# Altium schematic sheet child3.SchDoc
size A3
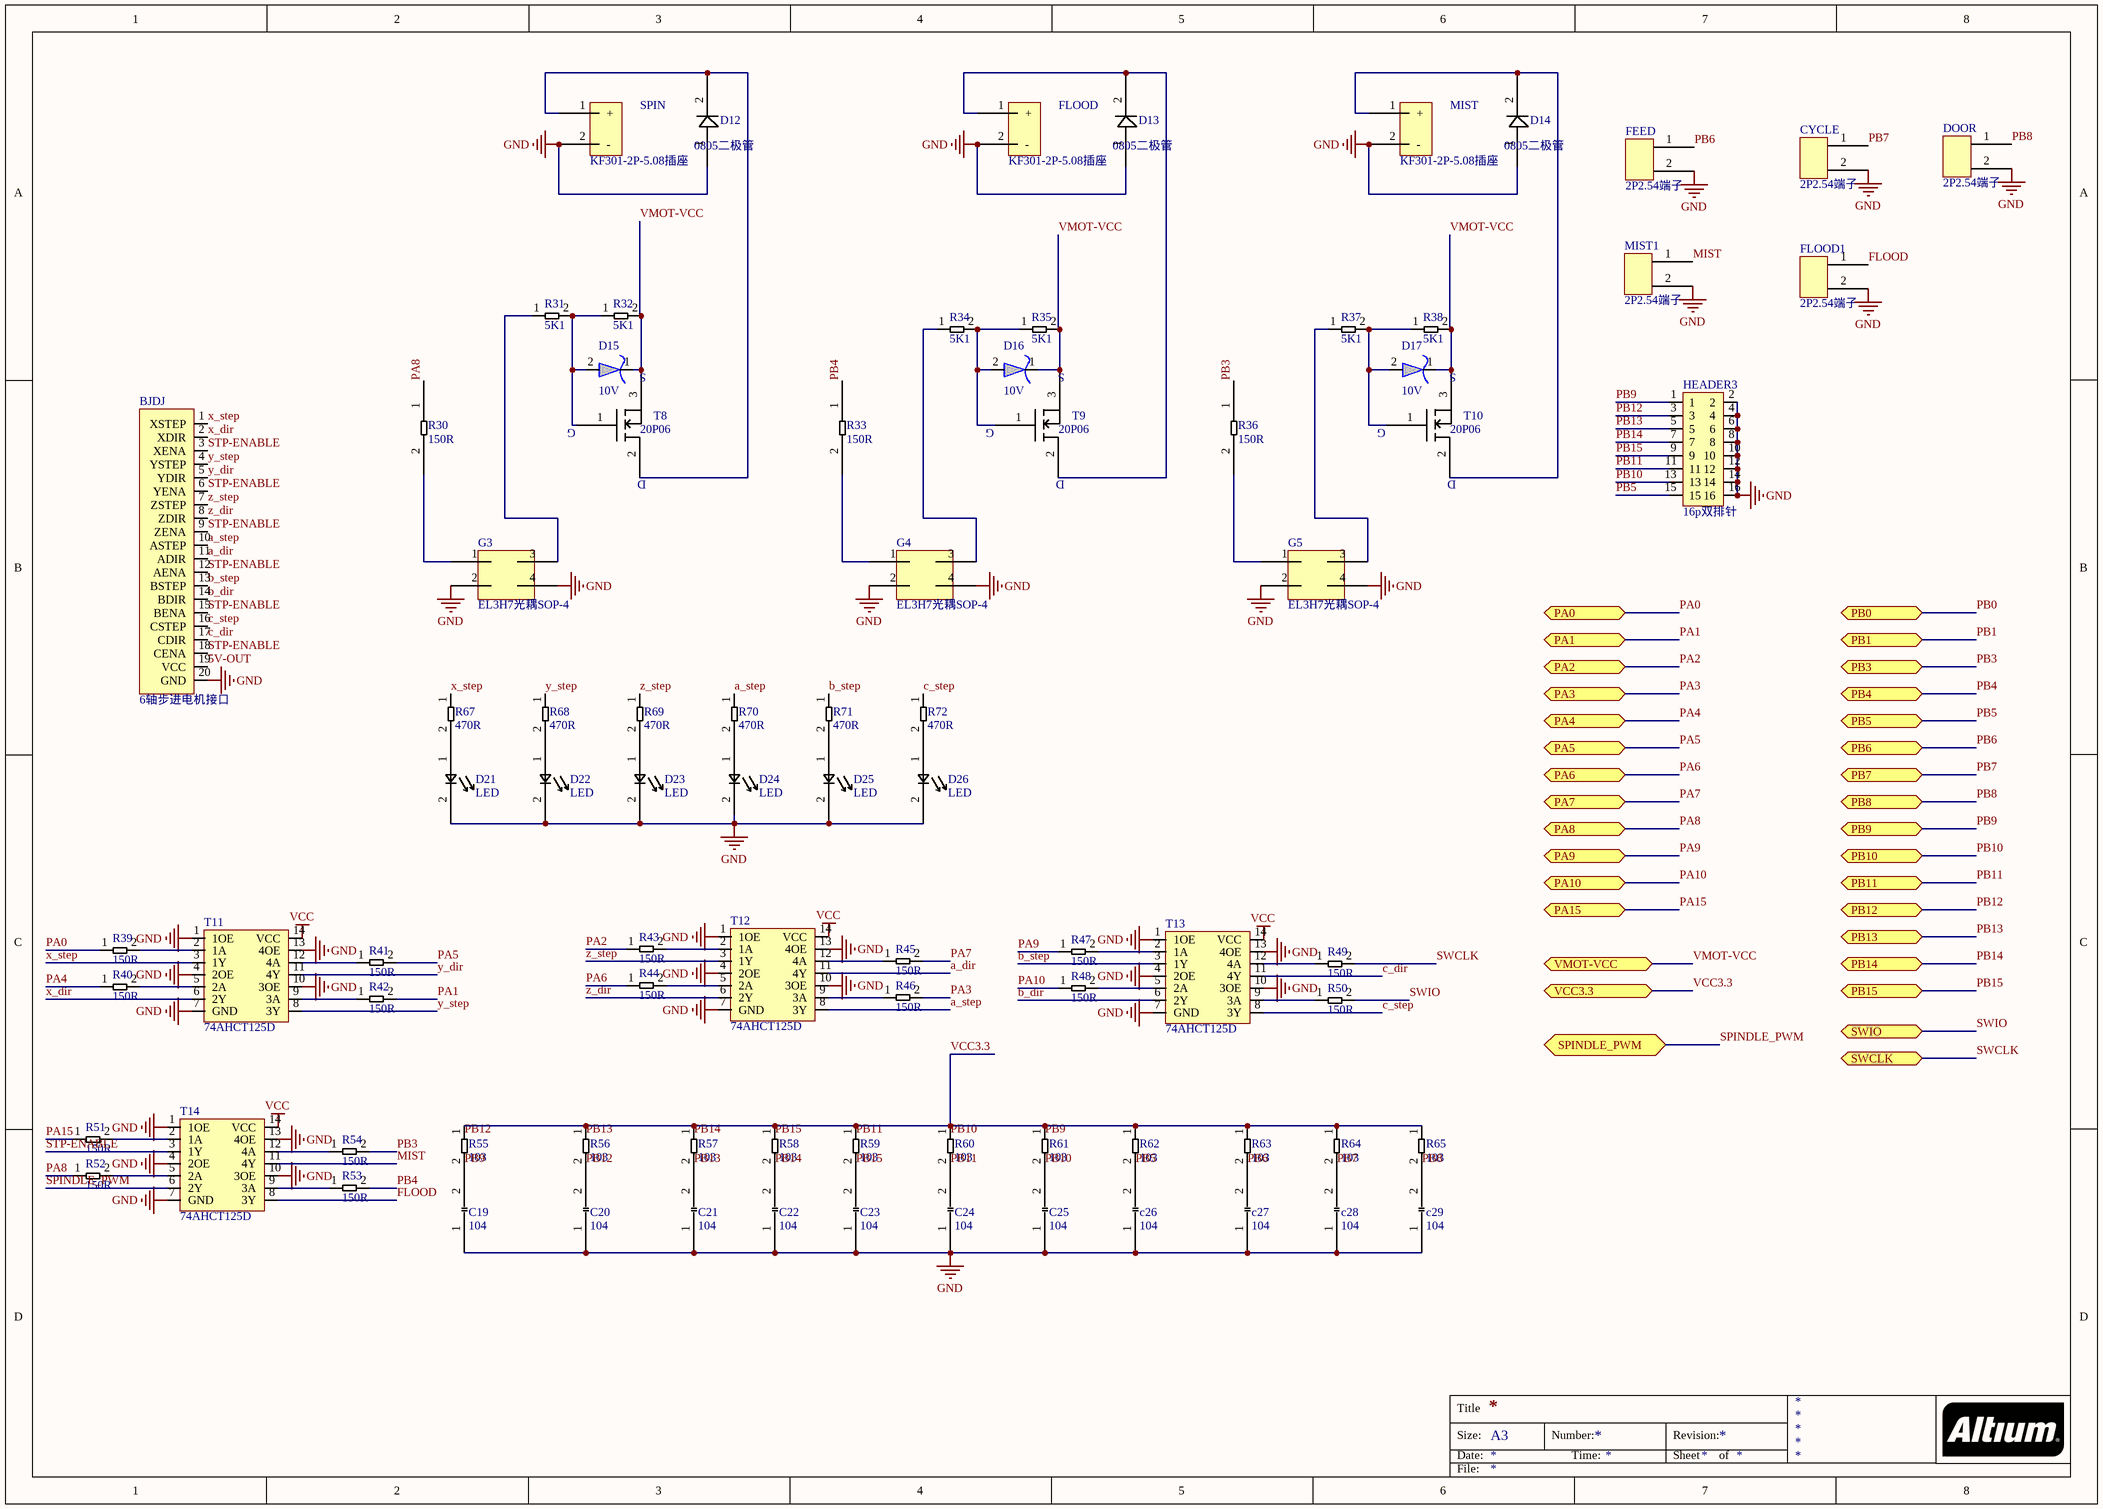
[diagram p0: child3.SchDoc]

## Parts
BJDJ  6轴步进电机接口  [KF301-20P]
C19  104  [0805电容]
C20  104  [0805电容]
C21  104  [0805电容]
C22  104  [0805电容]
C23  104  [0805电容]
C24  104  [0805电容]
C25  104  [0805电容]
c26  104  [0805电容]
c27  104  [0805电容]
c28  104  [0805电容]
c29  104  [0805电容]
CYCLE  2P2.54端子  [2p2.54端子]
D12  0805二极管  [0805-二极管]
D13  0805二极管  [0805-二极管]
D14  0805二极管  [0805-二极管]
D15  10V  [1/2w贴片稳压二极管]
D16  10V  [1/2w贴片稳压二极管]
D17  10V  [1/2w贴片稳压二极管]
D21  LED  [0805二极管]
D22  LED  [0805二极管]
D23  LED  [0805二极管]
D24  LED  [0805二极管]
D25  LED  [0805二极管]
D26  LED  [0805二极管]
DOOR  2P2.54端子  [2p2.54端子]
FEED  2P2.54端子  [2p2.54端子]
FLOOD  KF301-2P-5.08插座  [KF301-2P-5.08插座]
FLOOD1  2P2.54端子  [2p2.54端子]
G3  EL3H7光耦SOP-4  [EL3H7SOP-4]
G4  EL3H7光耦SOP-4  [EL3H7SOP-4]
G5  EL3H7光耦SOP-4  [EL3H7SOP-4]
HEADER3  16p双排针  [16p双排针]
MIST  KF301-2P-5.08插座  [KF301-2P-5.08插座]
MIST1  2P2.54端子  [2p2.54端子]
R30  150R  [0805电阻]
R31  5K1  [0805电阻]
R32  5K1  [0805电阻]
R33  150R  [0805电阻]
R34  5K1  [0805电阻]
R35  5K1  [0805电阻]
R36  150R  [0805电阻]
R37  5K1  [0805电阻]
R38  5K1  [0805电阻]
R39  150R  [0805电阻]
R40  150R  [0805电阻]
R41  150R  [0805电阻]
R42  150R  [0805电阻]
R43  150R  [0805电阻]
R44  150R  [0805电阻]
R45  150R  [0805电阻]
R46  150R  [0805电阻]
R47  150R  [0805电阻]
R48  150R  [0805电阻]
R49  150R  [0805电阻]
R50  150R  [0805电阻]
R51  150R  [0805电阻]
R52  150R  [0805电阻]
R53  150R  [0805电阻]
R54  150R  [0805电阻]
R55  103  [0805电阻]
R56  103  [0805电阻]
R57  103  [0805电阻]
R58  103  [0805电阻]
R59  103  [0805电阻]
R60  103  [0805电阻]
R61  103  [0805电阻]
R62  103  [0805电阻]
R63  103  [0805电阻]
R64  103  [0805电阻]
R65  103  [0805电阻]
R67  470R  [0805电阻]
R68  470R  [0805电阻]
R69  470R  [0805电阻]
R70  470R  [0805电阻]
R71  470R  [0805电阻]
R72  470R  [0805电阻]
SPIN  KF301-2P-5.08插座  [KF301-2P-5.08插座]
T8  20P06  [to-252]
T9  20P06  [to-252]
T10  20P06  [to-252]
T11  74AHCT125D  [SOIC14]
T12  74AHCT125D  [SOIC14]
T13  74AHCT125D  [SOIC14]
T14  74AHCT125D  [SOIC14]

## Ports
PA0 (bidir), PA1 (bidir), PA2 (bidir), PA3 (bidir), PA4 (bidir), PA5 (bidir), PA6 (bidir), PA7 (bidir), PA8 (bidir), PA9 (bidir), PA10 (bidir), PA15 (bidir), PB0 (bidir), PB1 (bidir), PB3 (bidir), PB4 (bidir), PB5 (bidir), PB6 (bidir), PB7 (bidir), PB8 (bidir), PB9 (bidir), PB10 (bidir), PB11 (bidir), PB12 (bidir), PB13 (bidir), PB14 (bidir), PB15 (bidir), SPINDLE_PWM (bidir), SWCLK (bidir), SWIO (bidir), VCC3.3 (bidir), VMOT-VCC (bidir)

## Nets
GND: BJDJ.20(GND) C19.1 C20.1 C21.1 C22.1 C23.1 C24.1 C25.1 c26.1 c27.1 c28.1 c29.1 CYCLE.2 D12.1 D13.1 D14.1 D21.2 D22.2 D23.2 D24.2 D25.2 D26.2 DOOR.2 FEED.2 FLOOD.2(-) FLOOD1.2 G3.2 G3.4 G4.2 G4.4 G5.2 G5.4 HEADER3.2 HEADER3.4 HEADER3.6 HEADER3.8 HEADER3.10 HEADER3.12 HEADER3.14 HEADER3.16 MIST.2(-) MIST1.2 SPIN.2(-) T11.1(1OE) T11.4(2OE) T11.7(GND) T11.10(3OE) T11.13(4OE) T12.1(1OE) T12.4(2OE) T12.7(GND) T12.10(3OE) T12.13(4OE) T13.1(1OE) T13.4(2OE) T13.7(GND) T13.10(3OE) T13.13(4OE) T14.1(1OE) T14.4(2OE) T14.7(GND) T14.10(3OE) T14.13(4OE)
VCC: T11.14(VCC) T12.14(VCC) T13.14(VCC) T14.14(VCC)
5V-OUT: BJDJ.19(VCC)
a_dir: BJDJ.11(ADIR) T12.11(4Y)
a_step: BJDJ.10(ASTEP) R70.1 T12.8(3Y)
b_dir: BJDJ.14(BDIR) T13.6(2Y)
b_step: BJDJ.13(BSTEP) R71.1 T13.3(1Y)
c_dir: BJDJ.17(CDIR) T13.11(4Y)
c_step: BJDJ.16(CSTEP) R72.1 T13.8(3Y)
FLOOD: FLOOD1.1 T14.8(3Y)
MIST: MIST1.1 T14.11(4Y)
PA0: R39.1 ; port PA0
PA1: R42.2 ; port PA1
PA2: R43.1 ; port PA2
PA3: R46.2 ; port PA3
PA4: R40.1 ; port PA4
PA5: R41.2 ; port PA5
PA6: R44.1 ; port PA6
PA7: R45.2 ; port PA7
PA8: R30.1 R52.1 ; port PA8
PA9: R47.1 ; port PA9
PA10: R48.1 ; port PA10
PA15: R51.1 ; port PA15
PB0: port PB0
PB1: port PB1
PB3: R36.1 R54.2 ; port PB3
PB4: R33.1 R53.2 ; port PB4
PB5: c26.2 HEADER3.15 R62.2 ; port PB5
PB6: c27.2 FEED.1 R63.2 ; port PB6
PB7: c28.2 CYCLE.1 R64.2 ; port PB7
PB8: c29.2 DOOR.1 R65.2 ; port PB8
PB9: C19.2 HEADER3.1 R55.2 ; port PB9
PB10: C25.2 HEADER3.13 R61.2 ; port PB10
PB11: C24.2 HEADER3.11 R60.2 ; port PB11
PB12: C20.2 HEADER3.3 R56.2 ; port PB12
PB13: C21.2 HEADER3.5 R57.2 ; port PB13
PB14: C22.2 HEADER3.7 R58.2 ; port PB14
PB15: C23.2 HEADER3.9 R59.2 ; port PB15
SPINDLE_PWM: T14.6(2Y) ; port SPINDLE_PWM
STP-ENABLE: BJDJ.3(XENA) BJDJ.6(YENA) BJDJ.9(ZENA) BJDJ.12(AENA) BJDJ.15(BENA) BJDJ.18(CENA) T14.3(1Y)
SWCLK: R49.2 ; port SWCLK
SWIO: R50.2 ; port SWIO
VCC3.3: R55.1 R56.1 R57.1 R58.1 R59.1 R60.1 R61.1 R62.1 R63.1 R64.1 R65.1 ; port VCC3.3
VMOT-VCC: D15.1 D16.1 D17.1 R32.2 R35.2 R38.2 T8.3 T9.3 T10.3 ; port VMOT-VCC
x_dir: BJDJ.2(XDIR) T11.6(2Y)
x_step: BJDJ.1(XSTEP) R67.1 T11.3(1Y)
y_dir: BJDJ.5(YDIR) T11.11(4Y)
y_step: BJDJ.4(YSTEP) R68.1 T11.8(3Y)
z_dir: BJDJ.8(ZDIR) T12.6(2Y)
z_step: BJDJ.7(ZSTEP) R69.1 T12.3(1Y)
NetD12_2: D12.2 SPIN.1(+) T8.2
NetD13_2: D13.2 FLOOD.1(+) T9.2
NetD14_2: D14.2 MIST.1(+) T10.2
NetD15_2: D15.2 R31.2 R32.1 T8.1
NetD16_2: D16.2 R34.2 R35.1 T9.1
NetD17_2: D17.2 R37.2 R38.1 T10.1
NetD21_1: D21.1 R67.2
NetD22_1: D22.1 R68.2
NetD23_1: D23.1 R69.2
NetD24_1: D24.1 R70.2
NetD25_1: D25.1 R71.2
NetD26_1: D26.1 R72.2
NetG3_1: G3.1 R30.2
NetG3_3: G3.3 R31.1
NetG4_1: G4.1 R33.2
NetG4_3: G4.3 R34.1
NetG5_1: G5.1 R36.2
NetG5_3: G5.3 R37.1
NetR39_2: R39.2 T11.2(1A)
NetR40_2: R40.2 T11.5(2A)
NetR41_1: R41.1 T11.12(4A)
NetR42_1: R42.1 T11.9(3A)
NetR43_2: R43.2 T12.2(1A)
NetR44_2: R44.2 T12.5(2A)
NetR45_1: R45.1 T12.12(4A)
NetR46_1: R46.1 T12.9(3A)
NetR47_2: R47.2 T13.2(1A)
NetR48_2: R48.2 T13.5(2A)
NetR49_1: R49.1 T13.12(4A)
NetR50_1: R50.1 T13.9(3A)
NetR51_2: R51.2 T14.2(1A)
NetR52_2: R52.2 T14.5(2A)
NetR53_1: R53.1 T14.9(3A)
NetR54_1: R54.1 T14.12(4A)

## Notes on the sheet
- Labels drawn without touching a wire or pin: PB9, PB10, PB11, PB12, PB13, PB14, PB15
- Title
- Size:
- Date:
- A3
- Number:
- Time:
- Revision:
- Sheet
- of
- File:
- (in symbol 20P06场效应管) S; G; D

## Library data of the parts
C19-C25 c26-c29 = 0805贴片电容
D15-D17 = 贴片稳压二极管
D21-D26 = 0805贴片发光二极管
R30-R65 R67-R72 = 0805贴片电阻
T8-T10 = 20P06场效应管
T11-T14 = 74AHC125D